# Altium schematic sheet RS485_01.SchDoc
size 381 x 241 mm; SheetNumber: 1; SheetTotal: 3
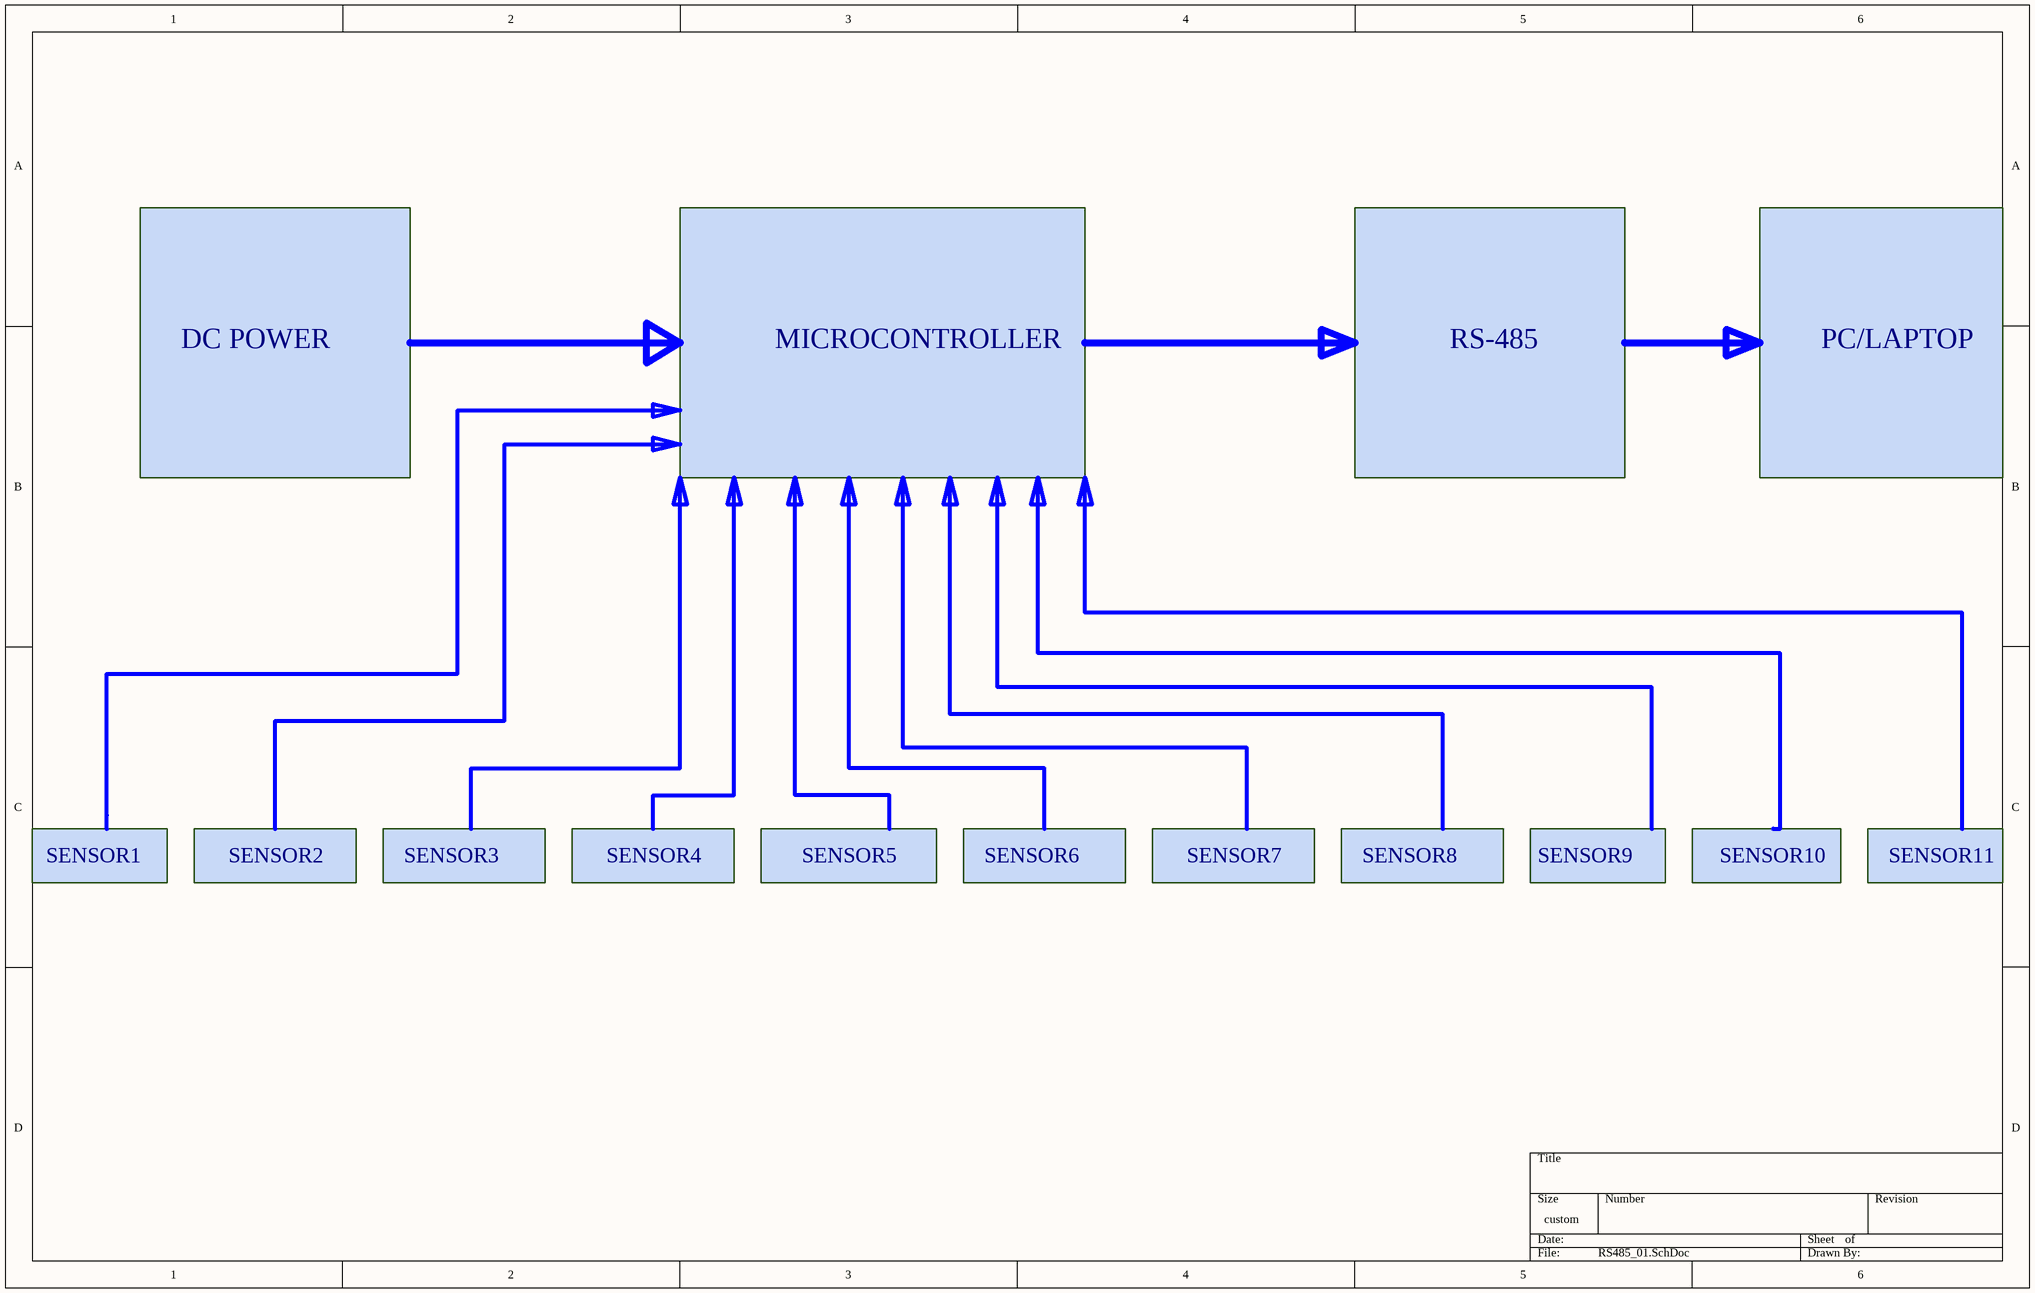
[diagram p0: RS485_01.SchDoc]

## Notes on the sheet
- DC POWER
- MICROCONTROLLER
- RS-485
- PC/LAPTOP
- SENSOR1
- SENSOR2
- SENSOR3
- SENSOR4
- SENSOR5
- SENSOR6
- SENSOR7
- SENSOR8
- SENSOR9
- SENSOR10
- SENSOR11